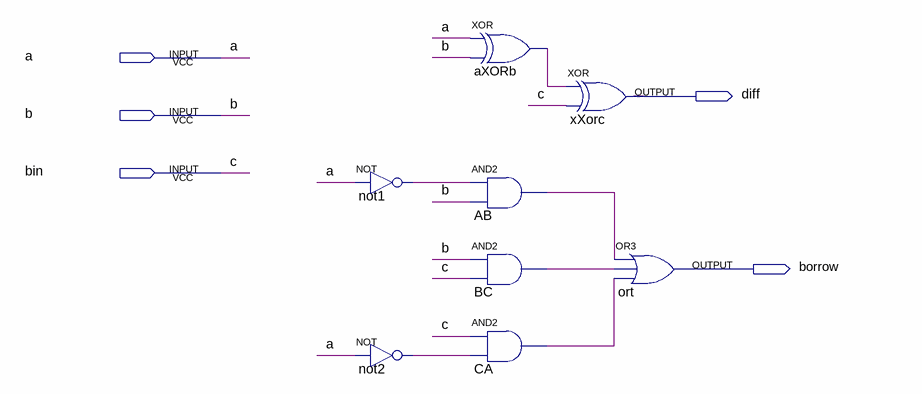
[diagram p0: schematic sheet]
// Quartus schematic FS.bdf as structural Verilog: 8 symbols, 5 pins
module FS (
  input  a,
  input  b,
  input  bin,
  output diff,
  output borrow
);

  wire AB_out, aXORb_out, BC_out, CA_out, not1_out, not2_out;

  not not1 (not1_out, a);
  not not2 (not2_out, a);
  xor aXORb (aXORb_out, a, b);
  and AB (AB_out, not1_out, b);
  and BC (BC_out, b, bin);
  and CA (CA_out, bin, not2_out);
  xor xXorc (diff, aXORb_out, bin);
  or ort (borrow, AB_out, BC_out, CA_out);

  // Other names for the same wires on the sheet: c = bin
endmodule
